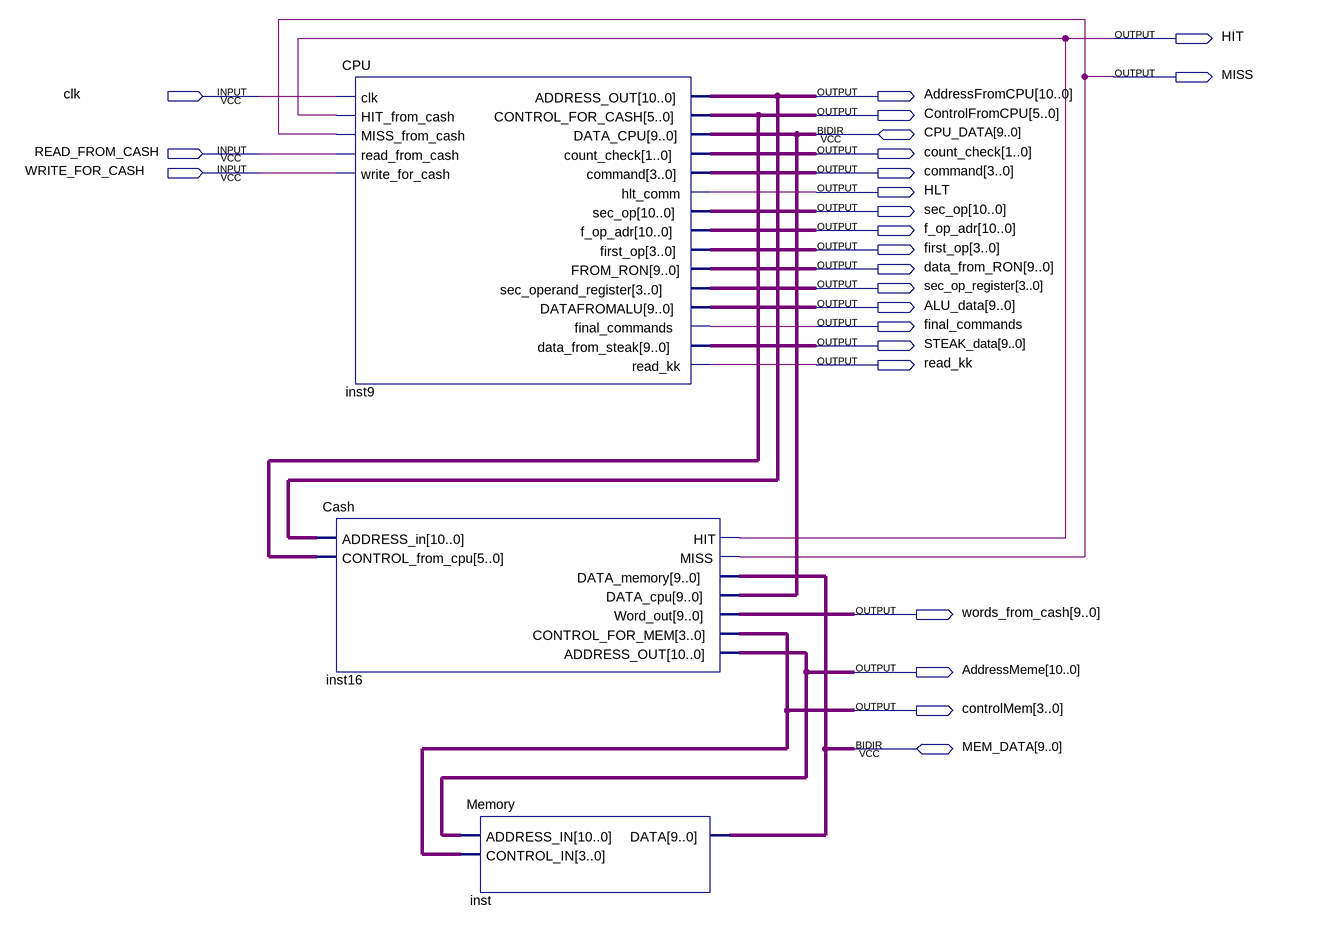
[diagram p0: schematic sheet]
// Quartus schematic main.bdf as structural Verilog: 3 symbols, 24 pins
module main (
  input  clk,
  input  READ_FROM_CASH,
  input  WRITE_FOR_CASH,
  inout  [9:0] CPU_DATA,
  inout  [9:0] MEM_DATA,
  output HIT,
  output MISS,
  output [10:0] AddressFromCPU,
  output [5:0] ControlFromCPU,
  output [1:0] count_check,
  output [3:0] command,
  output HLT,
  output [10:0] sec_op,
  output [10:0] f_op_adr,
  output [3:0] first_op,
  output [9:0] data_from_RON,
  output [3:0] sec_op_register,
  output [9:0] ALU_data,
  output final_commands,
  output [9:0] STEAK_data,
  output read_kk,
  output [9:0] words_from_cash,
  output [10:0] AddressMeme,
  output [3:0] controlMem
);

  CPU inst9 (
    .clk(clk), .HIT_from_cash(HIT), .MISS_from_cash(MISS), .read_from_cash(READ_FROM_CASH),
    .write_for_cash(WRITE_FOR_CASH), .ADDRESS_OUT(AddressFromCPU), .CONTROL_FOR_CASH(ControlFromCPU),
    .count_check(count_check), .command(command), .hlt_comm(HLT), .sec_op(sec_op), .f_op_adr(f_op_adr),
    .first_op(first_op), .FROM_RON(data_from_RON), .sec_operand_register(sec_op_register),
    .DATAFROMALU(ALU_data), .final_commands(final_commands), .data_from_steak(STEAK_data), .read_kk(read_kk),
    .DATA_CPU(CPU_DATA));
  Cash inst16 (
    .ADDRESS_in(AddressFromCPU), .CONTROL_from_cpu(ControlFromCPU), .HIT(HIT), .MISS(MISS),
    .Word_out(words_from_cash), .CONTROL_FOR_MEM(controlMem), .ADDRESS_OUT(AddressMeme),
    .DATA_memory(MEM_DATA), .DATA_cpu(CPU_DATA));
  Memory inst (.ADDRESS_IN(AddressMeme), .CONTROL_IN(controlMem), .DATA(MEM_DATA));
endmodule
